# EAGLE design Adafruit PA1010D Mini GPS (EAGLE 9.5.0)
COMPANY: ADAFRUIT INDUSTRIES; DRAWN: KTOWN; REV: A
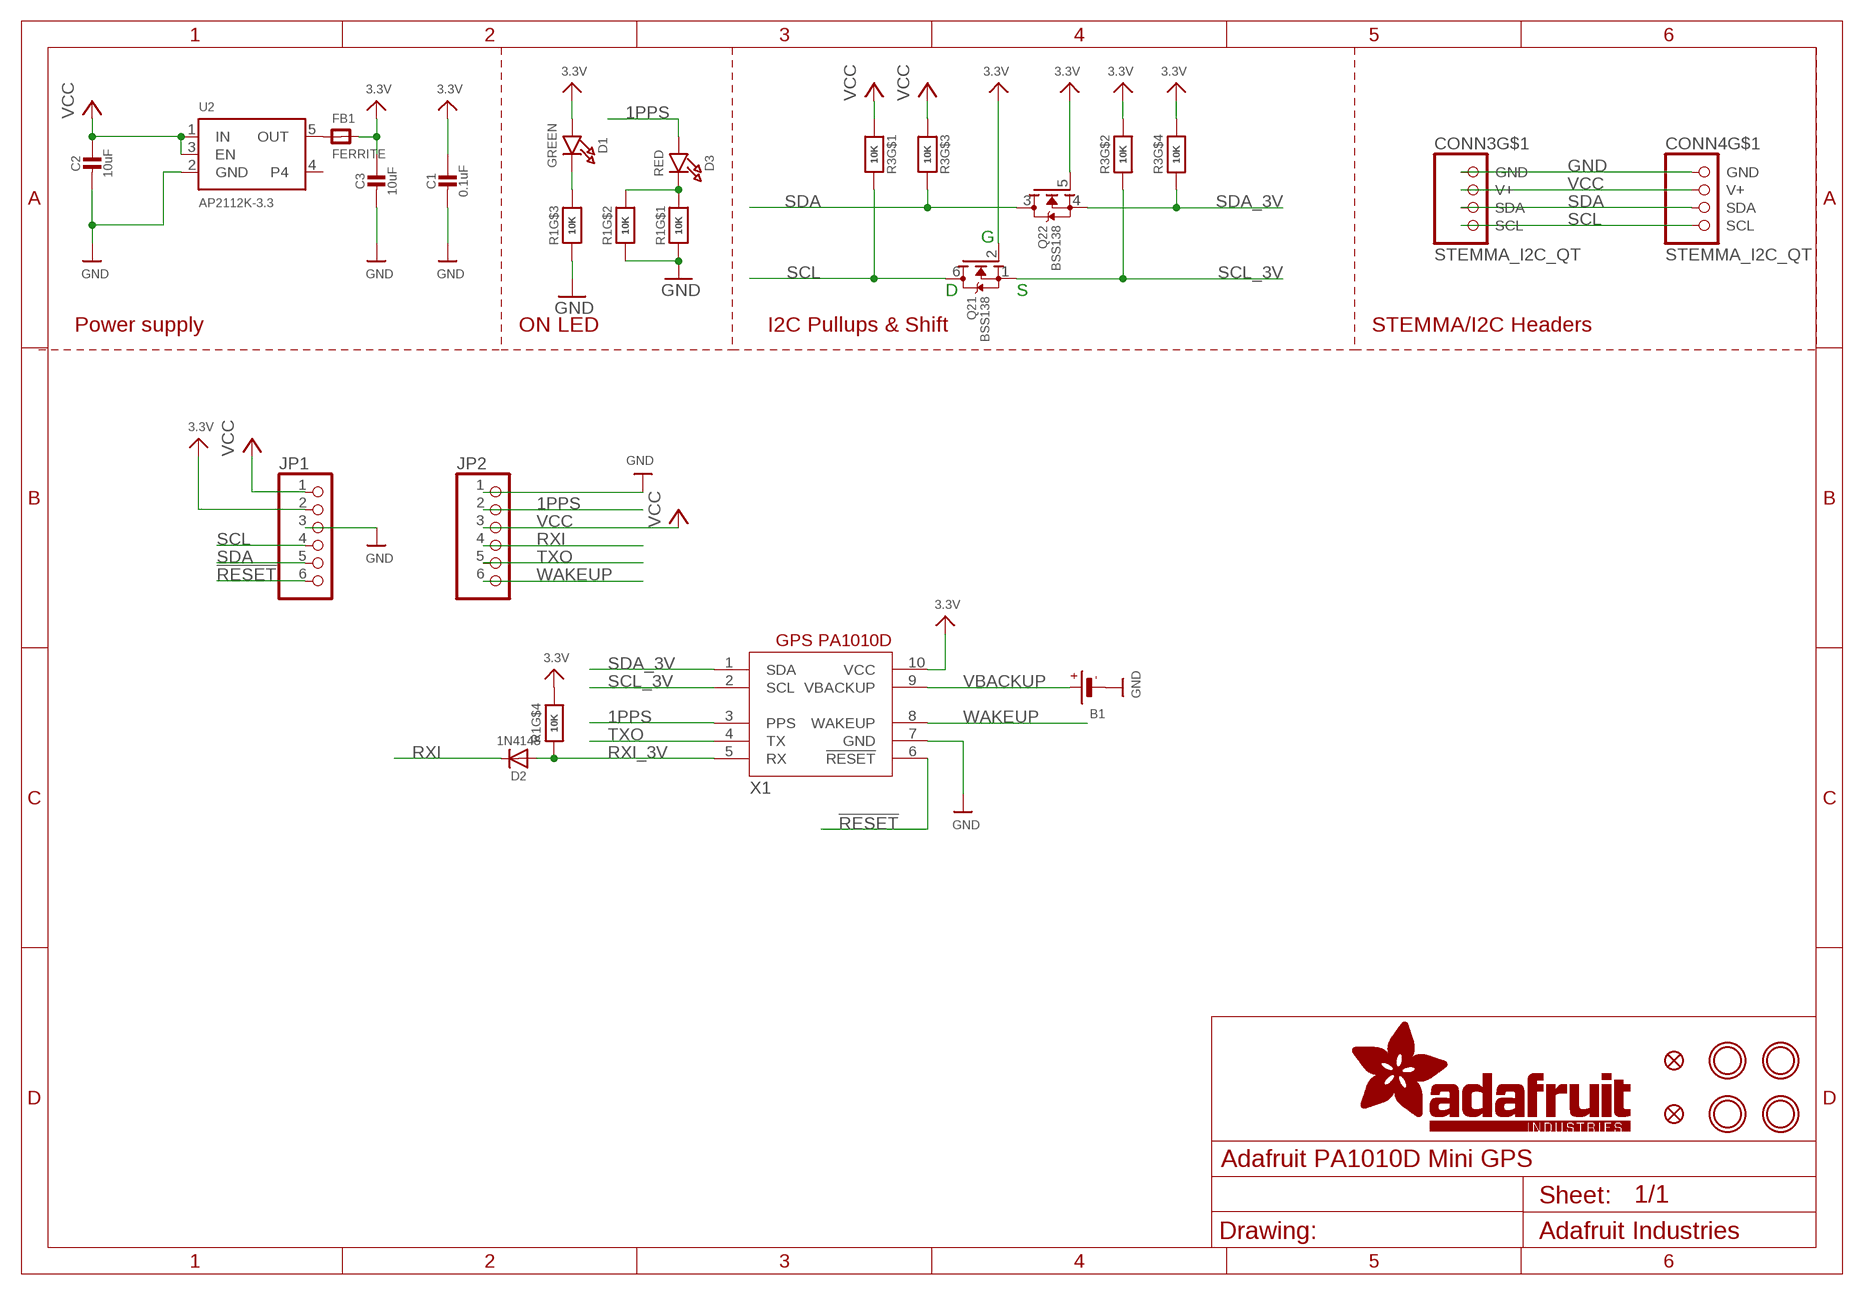
[diagram p0: schematic, sheet 1]

## Parts
B1  BATTERYCR1220_2  [CR1220-2]
C1  0.1uF  CAP_CERAMIC0603_NO  [0603-NO]
C2  10uF  CAP_CERAMIC0805-NOOUTLINE  [0805-NO]
C3  10uF  CAP_CERAMIC0805-NOOUTLINE  [0805-NO]
CONN3  STEMMA_I2C_QT  [JST_SH4]
CONN4  STEMMA_I2C_QT  [JST_SH4]
D1  GREEN  LED0603_NOOUTLINE  [CHIPLED_0603_NOOUTLINE]
D2  1N4148  DIODESOD-323  [SOD-323]
D3  RED  LED0603_NOOUTLINE  [CHIPLED_0603_NOOUTLINE]
FB1  FERRITE  FERRITE-0805NO  [0805-NO]
FID3  FIDUCIAL_1MM  [FIDUCIAL_1MM]
FID4  FIDUCIAL_1MM  [FIDUCIAL_1MM]
JP1  HEADER-1X670MIL  [1X06_ROUND_70]
JP2  HEADER-1X670MIL  [1X06_ROUND_70]
Q2  BSS138  MOSFET-N_DUAL  [SOT363]
R1  10K  RESISTOR_4PACK  [RESPACK_4X0603]
R3  10K  RESISTOR_4PACK  [RESPACK_4X0603]
U2  AP2112K-3.3  VREG_SOT23-5  [SOT23-5]
U$1  MOUNTINGHOLE2.5  [MOUNTINGHOLE_2.5_PLATED]
U$17  MOUNTINGHOLE2.5  [MOUNTINGHOLE_2.5_PLATED]
U$19  MOUNTINGHOLE2.5  [MOUNTINGHOLE_2.5_PLATED]
U$21  MOUNTINGHOLE2.5  [MOUNTINGHOLE_2.5_PLATED]
X1  GPS_PA1010D  [GPS_PA1010D]

## Nets
1PPS: D3.A JP2.2 X1.3(PPS)
3.3V [lowpower]: C1.1 C3.1 D1.A FB1.2 JP1.2 Q2.2(1:G) Q2.5(2:G) R1.4 R3.2 R3.4 X1.10(VCC)
!RESET: JP1.6 X1.6(!RESET)
GND [highpower]: B1.- C1.2 C2.2 C3.2 CONN3.1(GND) CONN4.1(GND) JP1.3 JP2.1 R1.1 R1.2 R1.3 U2.2(GND) X1.7(GND)
N$1: D1.C R1.6
N$2: D3.C R1.7 R1.8
OUT: FB1.1 U2.5(OUT)
RXI: D2.C JP2.4
RXI_3V: D2.A R1.5 X1.5(RX)
SCL: CONN3.4(SCL) CONN4.4(SCL) JP1.4 Q2.6(1:D) R3.8
SCL_3V: Q2.1(1:S) R3.7 X1.2(SCL)
SDA: CONN3.3(SDA) CONN4.3(SDA) JP1.5 Q2.3(2:D) R3.6
SDA_3V: Q2.4(2:S) R3.5 X1.1(SDA)
TXO: JP2.5 X1.4(TX)
VBACKUP: B1.+ X1.9(VBACKUP)
VCC [highpower]: C2.1 CONN3.2(V+) CONN4.2(V+) JP1.1 JP2.3 R3.1 R3.3 U2.1(IN) U2.3(EN)
WAKEUP: JP2.6 X1.8(WAKEUP)
Unconnected: CONN3.MT1(MT) CONN3.MT2(MT) CONN4.MT1(MT) CONN4.MT2(MT) U2.4

## Notes on the sheet
- G
- D | S
- Power supply | ON LED | I2C Pullups & Shift | STEMMA/I2C Headers

## Library data of the parts
B1 = microbuilder:BATTERY: CR1220 SMT - Digikey: 3001K-ND CD2032 BAT-HLD-001 - Digikey: BAT-HLD-001-ND
C1-C3 = microbuilder:CAP_CERAMIC: Ceramic Capacitors For new designs, use the packages preceded by an '_' character since they are more reliable: The following footprints should be used on most boards: _0402 - Standard footprint for regular board layouts _0603 - Standard footprint for regular board layouts _0805 - Standard footprint for regular board layouts _1206 - Standard footprint for regular board layouts For extremely tight-pitch boards where space is at a premium, the following 'micro-pitch' footprints can be used (smaller pads, no silkscreen outline, etc.): _0402MP - Micro-pitch footprint for very dense/compact boards _0603MP - Micro-pitch footprint for very dense/compact boards _0805MP - Micro-pitch footprint for very dense/compact boards _1206MP - Micro-pitch footprint for very dense/compact boards
CONN3 CONN4 = microbuilder:STEMMA_I2C
D1 D3 = microbuilder:LED: LED 0603 - 0603 Surface Mount Package 2mA: Green LED - Low Power (3.9mcd, 2ma, 1.7Vf) - Digikey: 475-2709-2-ND Orange LED - Low Power (9.8mcd, 2ma, 1.8Vf) - Digikey: 475-1194-2-ND Red LED - Low Power (5mcd, 2ma, 1.8Vf) - Digikey: 475-1195-2-ND Yellow LED - Low Power (7mcd, 2ma, 1.8Vf) - Digikey: 475-1196-2-ND 5mA: Blue LED - Low Power (17mcd, 5ma, 2.9Vf) - Digikey: LNJ937W8CRACT-ND 0805 - 0805 Surface Mount Package 2mA: Red LED (8.8mcd, 2mA, 1.8Vf, Clear) - Low Power [Digikey: 475-2510-1-ND] Green LED (5mcd, 2mA, 1.8Vf, Clear) - Low Power [Digikey: 475-2730-1-ND] Yellow LED (11.3mcd, 2mA, 1.8Vf, Clear) - Low Power [Digikey: 475-2555-1-ND] 20mA: Red LED (104mcd, 20mA, Diffused) - LS R976 [Digikey: 475-1278-6-ND] Red LED (12mcd, 20mA, 2.0Vf, Clear) - APT2012EC [Digikey: 754-1128-1-ND] Green LED (15mcd, 20mA, 2.2Vf, Clear) - APT2012GC [Digikey: 754-1131-1-ND] Orange LED (160mcd, 20mA, 2.1Vf, Clear) - APT2012SECK [Digikey: 754-1130-1-ND] 1206 - 1206 Surface Mount Package Green LED (26mcd, 20mA, Diffused) - LG N971 [Digikey: 475-1407-6-ND] Red LED (15mcd, 20mA, Diffused) - LH N974 [Digikey: 475-1416-6-ND] Cree - Cree High-Power Surface Mount LEDs XPEBWT-L1-0000-00D50 - White 111lm 350mA 2.9Vf 6200K 110° XTEAWT-00-0000-00000LEE3 - White 114lm 350mA 2.85Vf 5000K 115° Everlight - Everlight 45-21 Series Surface Mount LEDs 45-21/QK2C-B2832AC2CB2/2T - Warm White 2000mcd 20mA 3.25Vf 3050K 120° 45-21/LK2C-B38452C4CB2/2T - Nuetral White 2000mcd 20mA 3.25Vf 4150K 120° 45-21/LK2C-B50634C6CB2/2T - Cold White 2200mcd 20mA 3.25Vf 5650K 120° PLCC2 Reverse Mount LS T77K-J1L2-1-0-2-R18-Z - Red 11.25mcd 2mA 1.8Vf 630nm 120° LO T77K-L1M2-24-Z - Orange 19.6mcd 2mA 1.8Vf 606nm 120° LY T77K-K2M1-26-Z - Yellow 15.7mcd 2mA 1.8Vf 587nm 120°
D2 = microbuilder:DIODE: Diode SMA Model Volts Amps Type Vf Ir Digikey # Notes SSA34-E3 40V 3A Schottky 480mV @ 3A 200uA @ 40V SSA34-E3/61TGITR-ND CDBA120-G 20V 1A Schottky 500mV @ 1A 500uA @ 20V 641-1014-6-ND REEL MBRA210 10V 2A Schottky 350mV @ 2A 700uA @ 10V MBRA210LT3 SOD-123 Model Volts Amps Type Vf Ir Order # Notes BAT54T1G 30V 200mA Schottky 800mV @ 200mA 2uA @ 25V BAT54T1GOSTR-ND B0530W 30V 500mA Schottky 430mV @ 500mA 130uA @ 30V B0530W-FDICT-ND REEL MBR120 20V 1A Schottky 340mV @ 1A MBR120VLSFT1GOSCT-ND SOD-323 Model Volts Amps Type Vf Ir Order # Notes PMEG2005EJ 20V 500mA Schottky 355mV @ 500mA 568-4110-1-ND ZLLS410 10V 570mA Schottky 380mV @ 570mA ZLLS410CT-ND 1N4148WS 75V 150mA Silicon/Simple 1V 1N4148WSFSCT-ND REEL SOD-523 Model Volts Amps Type Vf Ir Order # Notes BAT54XV2 30V 200mA Schottky 0.8V @ 100mA BAT54XV2CT-ND TB751S 30V 30mA Schottky RB751S-40TE61CT-ND SOT23-R/W (R = Solder Paste/Reflow Ovens, W = Hand-Soldering) Model Volts Amps Type Vf Ir Order # Notes BAT54FILM 40V 300mA Schottky 497-7162-1-ND POWERDI-5 Model Volts Amps Type Vf Ir Order # Notes PDS560 60V 5A Schottky 670mV @ 5A 150uA @ 60V PDS560DICT-ND
FB1 = microbuilder:FERRITE: Ferrite Bead 0603 MMZ1608B121C - 120 Ohm @ 100MHz, 600mA, 0.15 Ohm DC Resistance - Digikey: 445-2164-1-ND BK1608HW121-T - 120 Ohm, 600mA Ferrite Chip - Digikey: 587-1876-2-ND 0805 HZ0805B272R-10 - 2.7K Ohm @ 100MHz, 200mA, 0.8 Ohm DC Resistance - Digikey: 240-2504-1-ND (see also Murata BLM21BD272SN1L) MMZ2012Y152B - 1.5K Ohm @ 100MHz, 500mA, 0.4 Ohm DC Resistance - Digikey: 445-1560-1-ND - Mainly for high frequency (80-400MHz) MMZ2012R102A - 1K Ohm @ 100MHz, 500mA, 0.3 Ohm DC Resistance - Digikey: 445-1555-2-ND - More general purpose (10-200MHz)
FID3 FID4 = microbuilder:FIDUCIAL: Fiducial Alignment Points Various fiducial points for machine vision alignment.; BOM: EXCLUDE
JP1 JP2 = microbuilder:HEADER-1X6: PIN HEADER
Q2 = microbuilder:MOSFET-N_DUAL: Dual N-Channel MOSFET SOT363 (2.0x1.25mm) 2N7002PS - 60V, 320mA [Digikey: 568-5984-1-ND]
R1 R3 = microbuilder:RESISTOR_4PACK: Resistor Packs (4 resistors) 4 x 0603 10K 1/16W - Digikey: YC164J-10KCT-ND
U2 = microbuilder:VREG_SOT23-5: SOT23-5 Fixed Voltage Regulators Part Current Out V Out V In V Dropout θJA (°C/W) TJ (°C) Digikey Part No. ADP121 150mA 3.3V 3.4-5.5V 0.09V @ 150mA -- -- ADP121-AUJZ33R7CT-ND ADP121 150mA 3.0V 3.1-5.5V 0.09V @ 150mA -- -- ADP121-AUJZ30R7CT-ND ADP122 300mA 3.3V 3.4-5.5V 0.085V @ 300mA -- -- ADP122AUJZ-3.3-R7CT-ND ADP1712 300mA 3.3V 3.5-5.5V 0.17V @ 300mA -- -- ADP1712AUJZ-3.3-R7TR-ND AP7311 (Low Cost) 150mA 3.3V 3.5-6V 0.15V @ 150mA -- -- AP7311-33WG-7DICT-ND LD39015M18R 150mA 1.8V 1.9V-5.5V 0.08V @ 100mA -- -- 497-6977-1-ND LP2985A-33DBVR 150mA 3.3V 3.3-16V 0.28V @ 150mA 206 150 296-18479-1-ND MCP1824T-3302E/OT 300mA 3.3V 3.5V-6V 0.2V @ 300mA -- -- MCP1824T-3302E/OTCT-ND MIC5205-2.5YM5 TR 150mA 2.5V 2.7-16V 0.165V @ 150mA -- -- 576-1257-2-ND MIC5205-3.0YM5 TR 150mA 3.0V 3.2V-16V 0.165V @ 150mA -- -- 576-1258-2-ND MIC5205-3.3YM5 TR 150mA 3.3V 3.5V-16V 0.165V @ 150mA -- -- 576-1259-2-ND TPS780330220 150mA 3.3V+2.2V 3.6-5.5V 250mV Max -- -- 296-23332-1-ND TDA3663/N1,135 100mA 3.3V 3.5-45V 0.18V @ 50mA -- -- 568-5343-1-ND Max operating temp can be calculated using θJA, TJ (max junction temperature), and power in watts. Set the "Maximum Ambient Temperature" until it reaches TJ ("Max Junction Temperature"), which is the absolute limit for safe use of the regulator: Heat Sink Temperature Calculator <http://www.daycounter.com/Calculators/Heat-Sink-Temperature-Calculator.phtml> For example, With 12V source into a 3.3V LP2985 and a 30mA load, we are dissipating (12V-3.3V) * 0.03A = 0.261W. With a θJA of 206 °C/W, a TJ of 150°C, and 261mW we can safely use the chip without a heat sink up to 75°C (=147.1°C Junction Temperature).
U$1 U$17 U$19 U$21 = microbuilder:MOUNTINGHOLE: Mounting Hole For #2 screws (0.086"/2.18mm width, 0.094"/2.4mm hole) use 2.5mm; BOM: EXCLUDE
X1 = microbuilder:GPS_PA1010D

## Net classes
1 highpower: width 0.406 mm, drill 0.483 mm
2 lowpower: width 0.305 mm, drill 0.483 mm

## Board
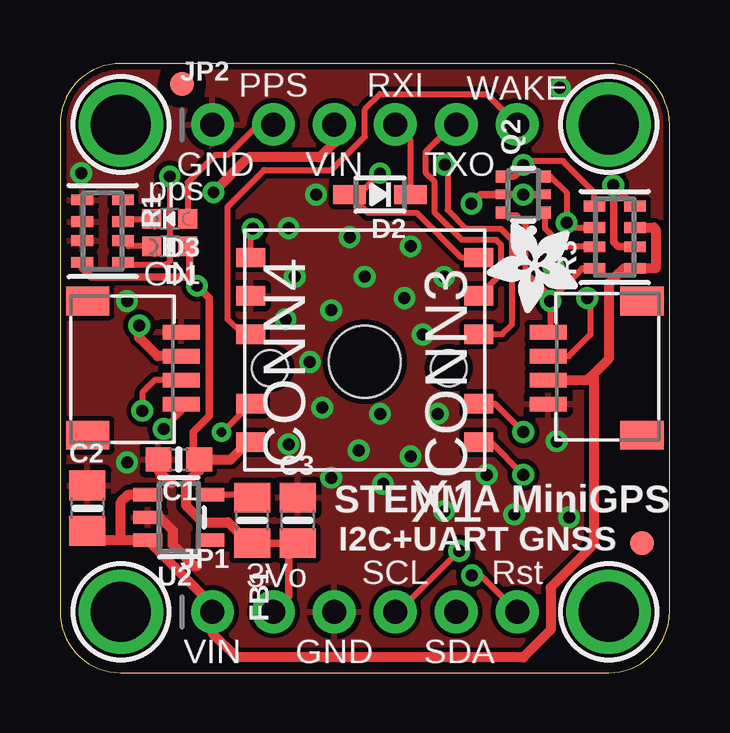
[diagram p1: board, top side]
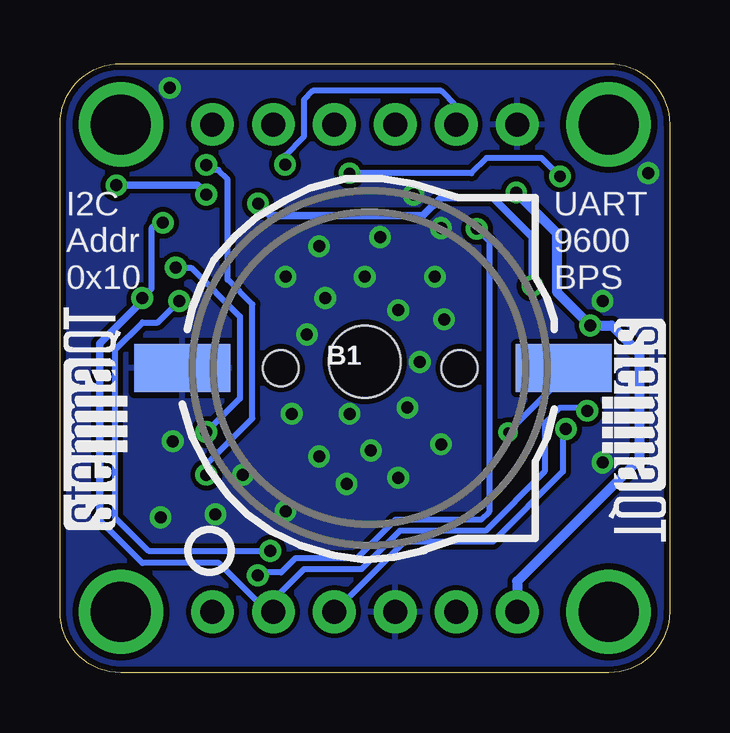
[diagram p2: board, bottom side, seen from below]

Size 25.4 x 25.4 mm. Coordinates in mm from the lower left corner, seen from the top.
Outline: 0,22.86 0,2.54 arc90 2.54,0 22.86,0 arc90 25.4,2.54 25.4,22.86 arc90 22.86,25.4 2.54,25.4 arc90 0,22.86
Copper layers (1*16): Top 0.035mm / dielectric 1.5mm / Bottom 0.035mm
Design rules "adafruit *": minimum track width 8mil, minimum drill 15.5mil, track to track 8mil, track to pad 8mil, pad to pad 8mil, via to via 8mil, smd to smd 8mil, copper to edge 10mil, drill to drill 8mil, minimum pad ring 10mil, minimum via ring 8mil, stop-mask expansion 2mil, vias tented up to drill 20mil, thermal gap 10mil

### Footprints (pad centres in the part's own frame; a part is rotated, then mirrored left to right if it is on the bottom)
CR1220-2 = smd 4 x 2: + 8.29,0; - -7.6,0 | hole 1.5: 3.95,0; -3.5,0
0603-NO = smd 1.075 x 1: 1 -0.85,0; 2 0.85,0
0805-NO = smd 1.24 x 1.5: 1 -0.95,0; 2 0.95,0
JST_SH4 = smd 0.6 x 1.55: 1 -1.5,2.514; 2 -0.5,2.514; 3 0.5,2.514; 4 1.5,2.514 | smd 1.2 x 1.8: MT1 -2.8,-1.386; MT2 2.8,-1.386
CHIPLED_0603_NOOUTLINE = smd 0.8 x 0.8: A 0,-0.75; C 0,0.75
SOD-323 = smd 1.35 x 0.8: A 1.27,0; C -1.27,0
FIDUCIAL_1MM = smd 1 x 1: 1 0,0
1X06_ROUND_70 = drill 1 pad 1.778: 1 -6.35,0; 2 -3.81,0; 3 -1.27,0; 4 1.27,0; 5 3.81,0; 6 6.35,0
SOT363 = smd 0.5 x 0.5: 1 -0.75,-0.9; 3 0.75,-0.9; 4 0.75,0.9; 6 -0.75,0.9 | smd 0.4 x 0.5: 2 0,-0.9; 5 0,0.9
RESPACK_4X0603 = smd 0.45 x 0.9: 1 -1.3,-0.85; 2 -0.4,-0.85; 3 0.4,-0.85; 4 1.3,-0.85; 5 1.3,0.85; 6 0.4,0.85; 7 -0.4,0.85; 8 -1.3,0.85
SOT23-5 = smd 0.55 x 1.2: 1 -0.95,-1.3; 2 0,-1.3; 3 0.95,-1.3; 4 0.95,1.3; 5 -0.95,1.3
MOUNTINGHOLE_2.5_PLATED = drill 2.5 pad 3.2: P$1 0,0
GPS_PA1010D = smd 1.2 x 0.8: 1 -4.75,3.85; 2 -4.75,2.25; 3 -4.75,-0.65; 4 -4.75,-2.25; 5 -4.75,-3.85; 6 4.75,-3.85; 7 4.75,-2.25; 8 4.75,-0.65; 9 4.75,2.25; 10 4.75,3.85 | hole 3: 0,0.5

### Placement (x,y rotation side)
B1  12.7,12.7 0 bottom
C1  4.95,8.89 180 top
C2  1.14,6.86 90 top
C3  9.91,6.35 90 top
CONN3  22.86,12.7 90 top
CONN4  2.54,12.7 270 top
D1  4.57,17.78 90 top
D2  13.34,19.94 180 top
D3  4.57,18.92 90 top
FB1  8,6.35 270 top
FID3  24.26,5.4 0 top
FID4  5.08,24.55 0 top
JP1  12.7,2.54 0 top
JP2  12.7,22.86 0 top
Q2  19.3,19.94 90 top
R1  1.78,18.41 270 top
R3  23.11,18.16 90 top
U2  4.95,6.48 270 top
U$1  2.54,22.86 0 top
U$17  22.86,22.86 0 top
U$19  2.54,2.54 0 top
U$21  22.86,2.54 0 top
U$22  [ADAFRUIT_3.5MM]  21.59,18.8 180 top
U$25  [PCBFEAT-REV-040]  19.18,5.08 0 bottom
U$30  [STEMMAQT]  22.61,5.97 90 bottom
U$31  [STEMMAQT]  2.79,14.73 270 bottom
X1  12.7,13.46 180 top

### Tracks (layer width: path | path; a pad name or v marks a point on that pad's centre or on a via)
1PPS  (via drill 0.5)
  Top 0.254: X1.3 18.43,14.11 18.84,14.52 18.84,18.04 18.38,18.5 16.96,18.5 16.15,19.31 16.15,21.06 v16.02,21.19 | D3.A 5.32,20.43 6.48,21.59 6.99,21.59 8.26,22.86 JP2.2
  Bottom 0.254: JP2.2 8.89,23.62 9.53,24.26 14.86,24.26 15.24,23.88 15.24,22.35 16.02,21.57 v16.02,21.19
3.3V  (via drill 0.48, 0.5)
  Top 0.305: Q2.2 v19.3,19.94 Q2.5 17.53,19.94 v17.14,19.56 | R3.4 23.91,19.46 v23.05,20.32 | 23.97,19.4 v23.05,20.32 | C1.1 5.55,9.14 5.55,10.03 6.22,10.71 6.22,15.62 v5.71,16.13 5.4,16.45 | D1.A 5.4,17.86 5.4,16.45 | v23.05,20.32 23.05,19.85 23.07,19.83 23.07,17.95 23.26,17.76 R3.2 | 5.4,16.45 5.34,16.5 1.3,16.5 0.93,16.88 R1.4 | FB1.2 9.53,5.4 | 9.53,5.4 C3.1 | JP1.2 9.53,3.17 9.53,5.4
  Top 0.406: FB1.2 7.87,5.4 7,6.27 5.96,6.27 5.25,6.98 5.25,7.87 5.8,8.43 C1.1 7.11,8.89 7.83,9.61 X1.10
  Bottom 0.305: v19.3,19.94 19.68,20.32 v23.05,20.32 | v17.14,19.56 16.64,19.05 10.29,19.05 9.53,19.81 7.37,19.81 5.71,18.16 v5.71,16.13
!RESET  (via drill 0.5)
  Top 0.254: v8.03,18.51 7.95,18.43 X1.6 | v17.16,4.06 17.53,4.06 JP1.6
  Bottom 0.254: v8.03,18.51 7.52,18 7.52,6.71 7.86,6.38 11.43,6.38 13.03,4.78 15.59,4.78 16.19,4.18 17.05,4.18 v17.16,4.06
GND  (via drill 0.5)
  Top 0.406: C2.2 1.46,7.81 | U2.2 4.15,6.48 4.7,5.93 4.7,5.34 5.6,4.45 5.71,4.45 | C1.2 4.1,8.43 4.64,7.89
  other vias: 16,16.51 12.7,16.51 9.78,16.51 12.06,18.16 14.61,17.78 14.35,15.62 15.11,14.1 11.3,15.11 10.41,12.95 15.75,10.79 13.34,10.79 10.92,11.05 9.53,9.53 12.45,9.27 14.61,9.02 17.78,8.26 20.7,9.65 21.21,6.48 18.92,6.6 16,6.73 13.46,7.87 11.3,8.13 9.4,14.73 2.79,8.76 9.53,18.54 2.79,15.49 0.89,20.83 10.67,19.94 20.83,24.38
  pour Bottom: 0,25.4 25.4,25.4 25.4,0 0,0
  pour Top: 0,25.4 25.4,25.4 25.4,0 0,0
N$1
  Top 0.254: D1.C 2.86,17.78 R1.6
N$2
  Top 0.254: R1.8 R1.7 2.74,18.92 D3.C
OUT
  Top 0.254: U2.5 7.87,7.43 FB1.1
RXI
  Top 0.254: D2.C 14.61,22.23 JP2.4
RXI_3V  (via drill 0.48)
  Top 0.254: X1.5 16.72,17.31 14.86,19.18 12.83,19.18 D2.A 12.45,19.94 v13.34,20.83 | R1.5 2.75,16.99 4.42,16.99 4.59,17.16 4.59,20.68 v4.57,20.7
  Bottom 0.254: v4.57,20.7 5.33,21.46 7.62,21.46 8.26,20.83 v13.34,20.83
SCL  (via drill 0.5)
  Top 0.254: CONN4.4 5.05,10.9 v4.32,10.16 | v16.64,5.08 14.1,2.54 JP1.4 | R3.8 21.76,16.86 20.48,15.59 | 20.48,15.59 20.43,15.54 v20.43,15.49 20.43,14.35 20.35,14.26 | 20.48,15.59 20.48,15.62 19.41,16.69 19.41,18.69 19.04,19.06 18.53,19.06 Q2.6
  Top 0.305: 20.35,14.26 CONN3.4
  Bottom 0.254: v4.32,10.16 4.45,10.03 4.45,8.38 7.37,5.46 11.05,5.46 JP1.4 | v16.64,5.08 21.72,5.08 23.11,6.48 23.11,13.45 21.96,14.61 21.32,14.61 v20.43,15.49
SCL_3V  (via drill 0.5)
  Top 0.254: X1.2 18.12,11.21 v19.3,10.03 | Q2.1 20.2,18.53 20.57,18.16 | 20.57,18.16 20.97,17.76 21.59,17.76 R3.7 | 20.57,18.16 v20.57,16.89 | R3.7
  Bottom 0.254: v20.57,16.89 19.94,16.89 17.91,14.86 17.91,11.43 v19.3,10.03
SDA  (via drill 0.5)
  Top 0.254: R3.6 21.44,18.56 21.25,18.76 v21.11,18.76 21.11,20.03 20.45,20.69 Q2.3 | CONN3.3 21.2,13.2 22.1,14.1 22.1,15.49 v21.97,15.62 | CONN4.3 3.94,12.2 3.43,11.68 v3.43,10.92
  Bottom 0.254: v21.97,15.62 21.59,16 21.59,18.53 21.36,18.76 v21.11,18.76 | v3.43,10.92 3.56,11.05 4.57,11.05 5.21,10.41 5.21,8.38 7.67,5.92 11.24,5.92 12.84,4.32 15.24,4.32 16.51,3.05 JP1.5 16.75,2.54 18.78,4.57 21.97,4.57 23.75,6.35
  Bottom 0.305: v21.97,15.62 21.91,15.56 23.75,13.72 23.75,6.35
SDA_3V  (via drill 0.5)
  Top 0.254: R3.5 22.26,20.03 20.95,21.34 19.47,21.34 v19.3,21.17 19.37,21.11 18.95,20.69 Q2.4 | X1.1 17.95,9.61 v19.3,8.26
  Bottom 0.254: v19.3,8.26 19.3,8.68 17.39,10.6 17.39,15.35 18.41,16.38 18.41,20.57 18.8,20.95 19.3,20.95 v19.3,21.17
TXO
  Top 0.254: X1.4 18.38,16.64 18.38,17.85 18.19,18.04 16.76,18.04 15.61,19.19 15.61,20.48 15.42,20.67 15.4,20.67 15.24,20.83 15.24,21.72 16.38,22.86 JP2.5
VBACKUP  (via drill 0.4)
  Top 0.254: X1.9 6.77,10.03 v6.73,10.03
  Bottom 0.254: B1.+ 4.41,12.35 v6.73,10.03
VCC  (via drill 0.48, 0.5)
  Top 0.406: 2.54,5.53 U2.3 6.35,2.83 JP1.1 6.35,1.65 7.37,0.64 19.3,0.64 20.45,1.78 20.45,3.56 22.23,5.34 22.23,12.45 | 2.54,5.53 2.29,5.53 1.52,5.53 C2.1 | CONN3.2 21.98,12.2 22.23,12.45 | 22.23,12.45 22.86,13.08 22.86,16.23 22.88,16.23 23.12,16.47 23.12,16.49 23.5,16.86 R3.1 24.82,16.86 24.82,18.49 24.75,18.56 R3.3 | CONN4.2 4.07,13.2 3.3,13.97 v3.3,14.48 | JP2.3 11.43,22.1 10.82,21.49 7.85,21.49 v6.39,20.03 | 2.54,5.53 2.54,7.11 2.85,7.43 U2.1
  Bottom 0.406: JP1.1 6.35,3.81 1.27,8.89 1.27,13.34 2.41,14.48 v3.3,14.48 4.7,15.88 4.7,18.34 v6.39,20.03
WAKEUP
  Top 0.254: X1.8 7.61,14.11 6.99,14.73 6.99,19.43 8.51,20.95 11.3,20.95 12.7,22.35 12.7,23.5 13.34,24.13 17.78,24.13 JP2.6

### Text on the board
tPlace: PPS | RXI | WAKE | GND | VIN | TXO | pps | ON | STEMMA MiniGPS | I2C+UART GNSS | 3Vo | SCL | Rst | VIN | GND | SDA
bPlace: UART / 9600 / BPS | I2C / Addr / 0x10